# EAGLE schematic ER-524D_CoilDriver24 (EAGLE 7.4.0)
DOC_NUM: DR20000193; DOC_TITLE: Coil Driver 50ch; REV: 00
Assembly variants: 11Hz 1Vo-p, 80Hz 1Vo-p, ER-524D

## Sheet 1 of 4
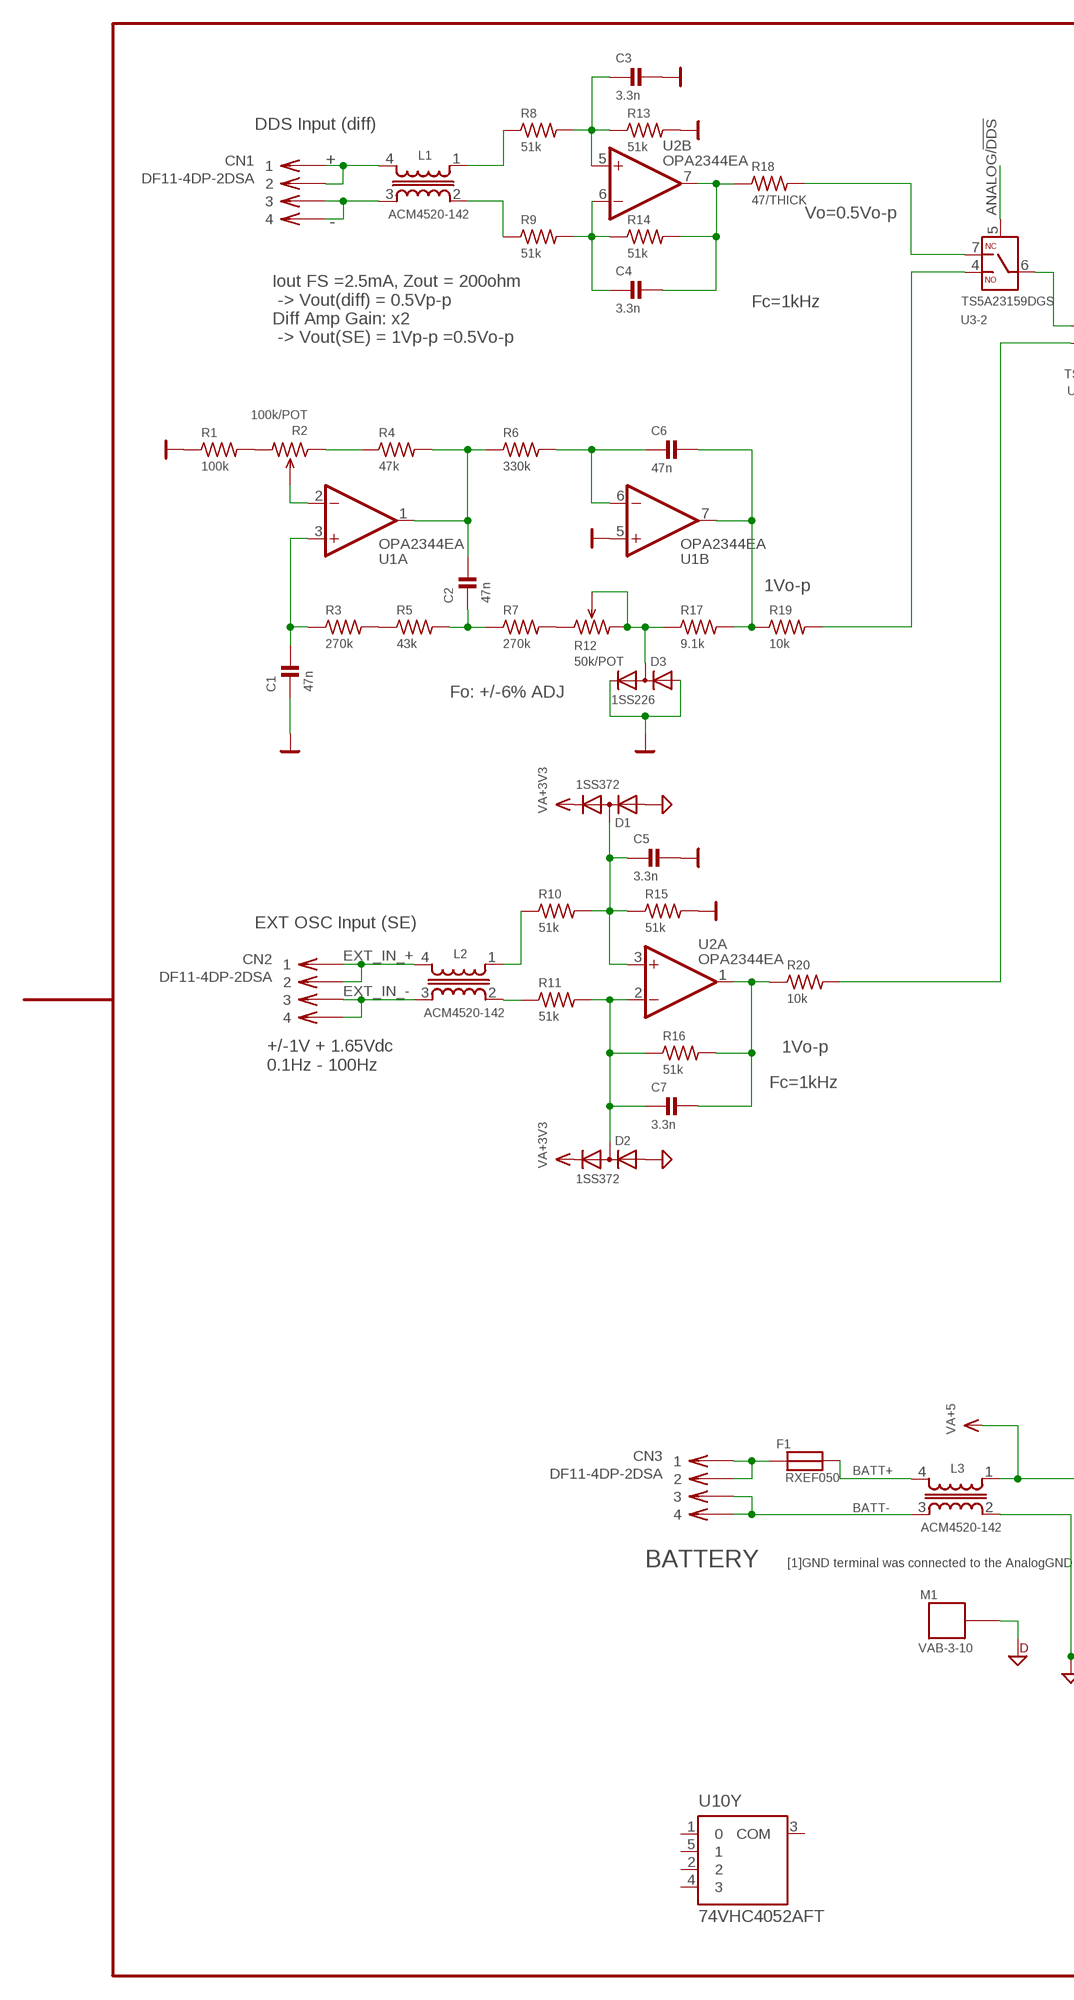
[diagram p0: schematic, sheet 1, part 1 of 2]
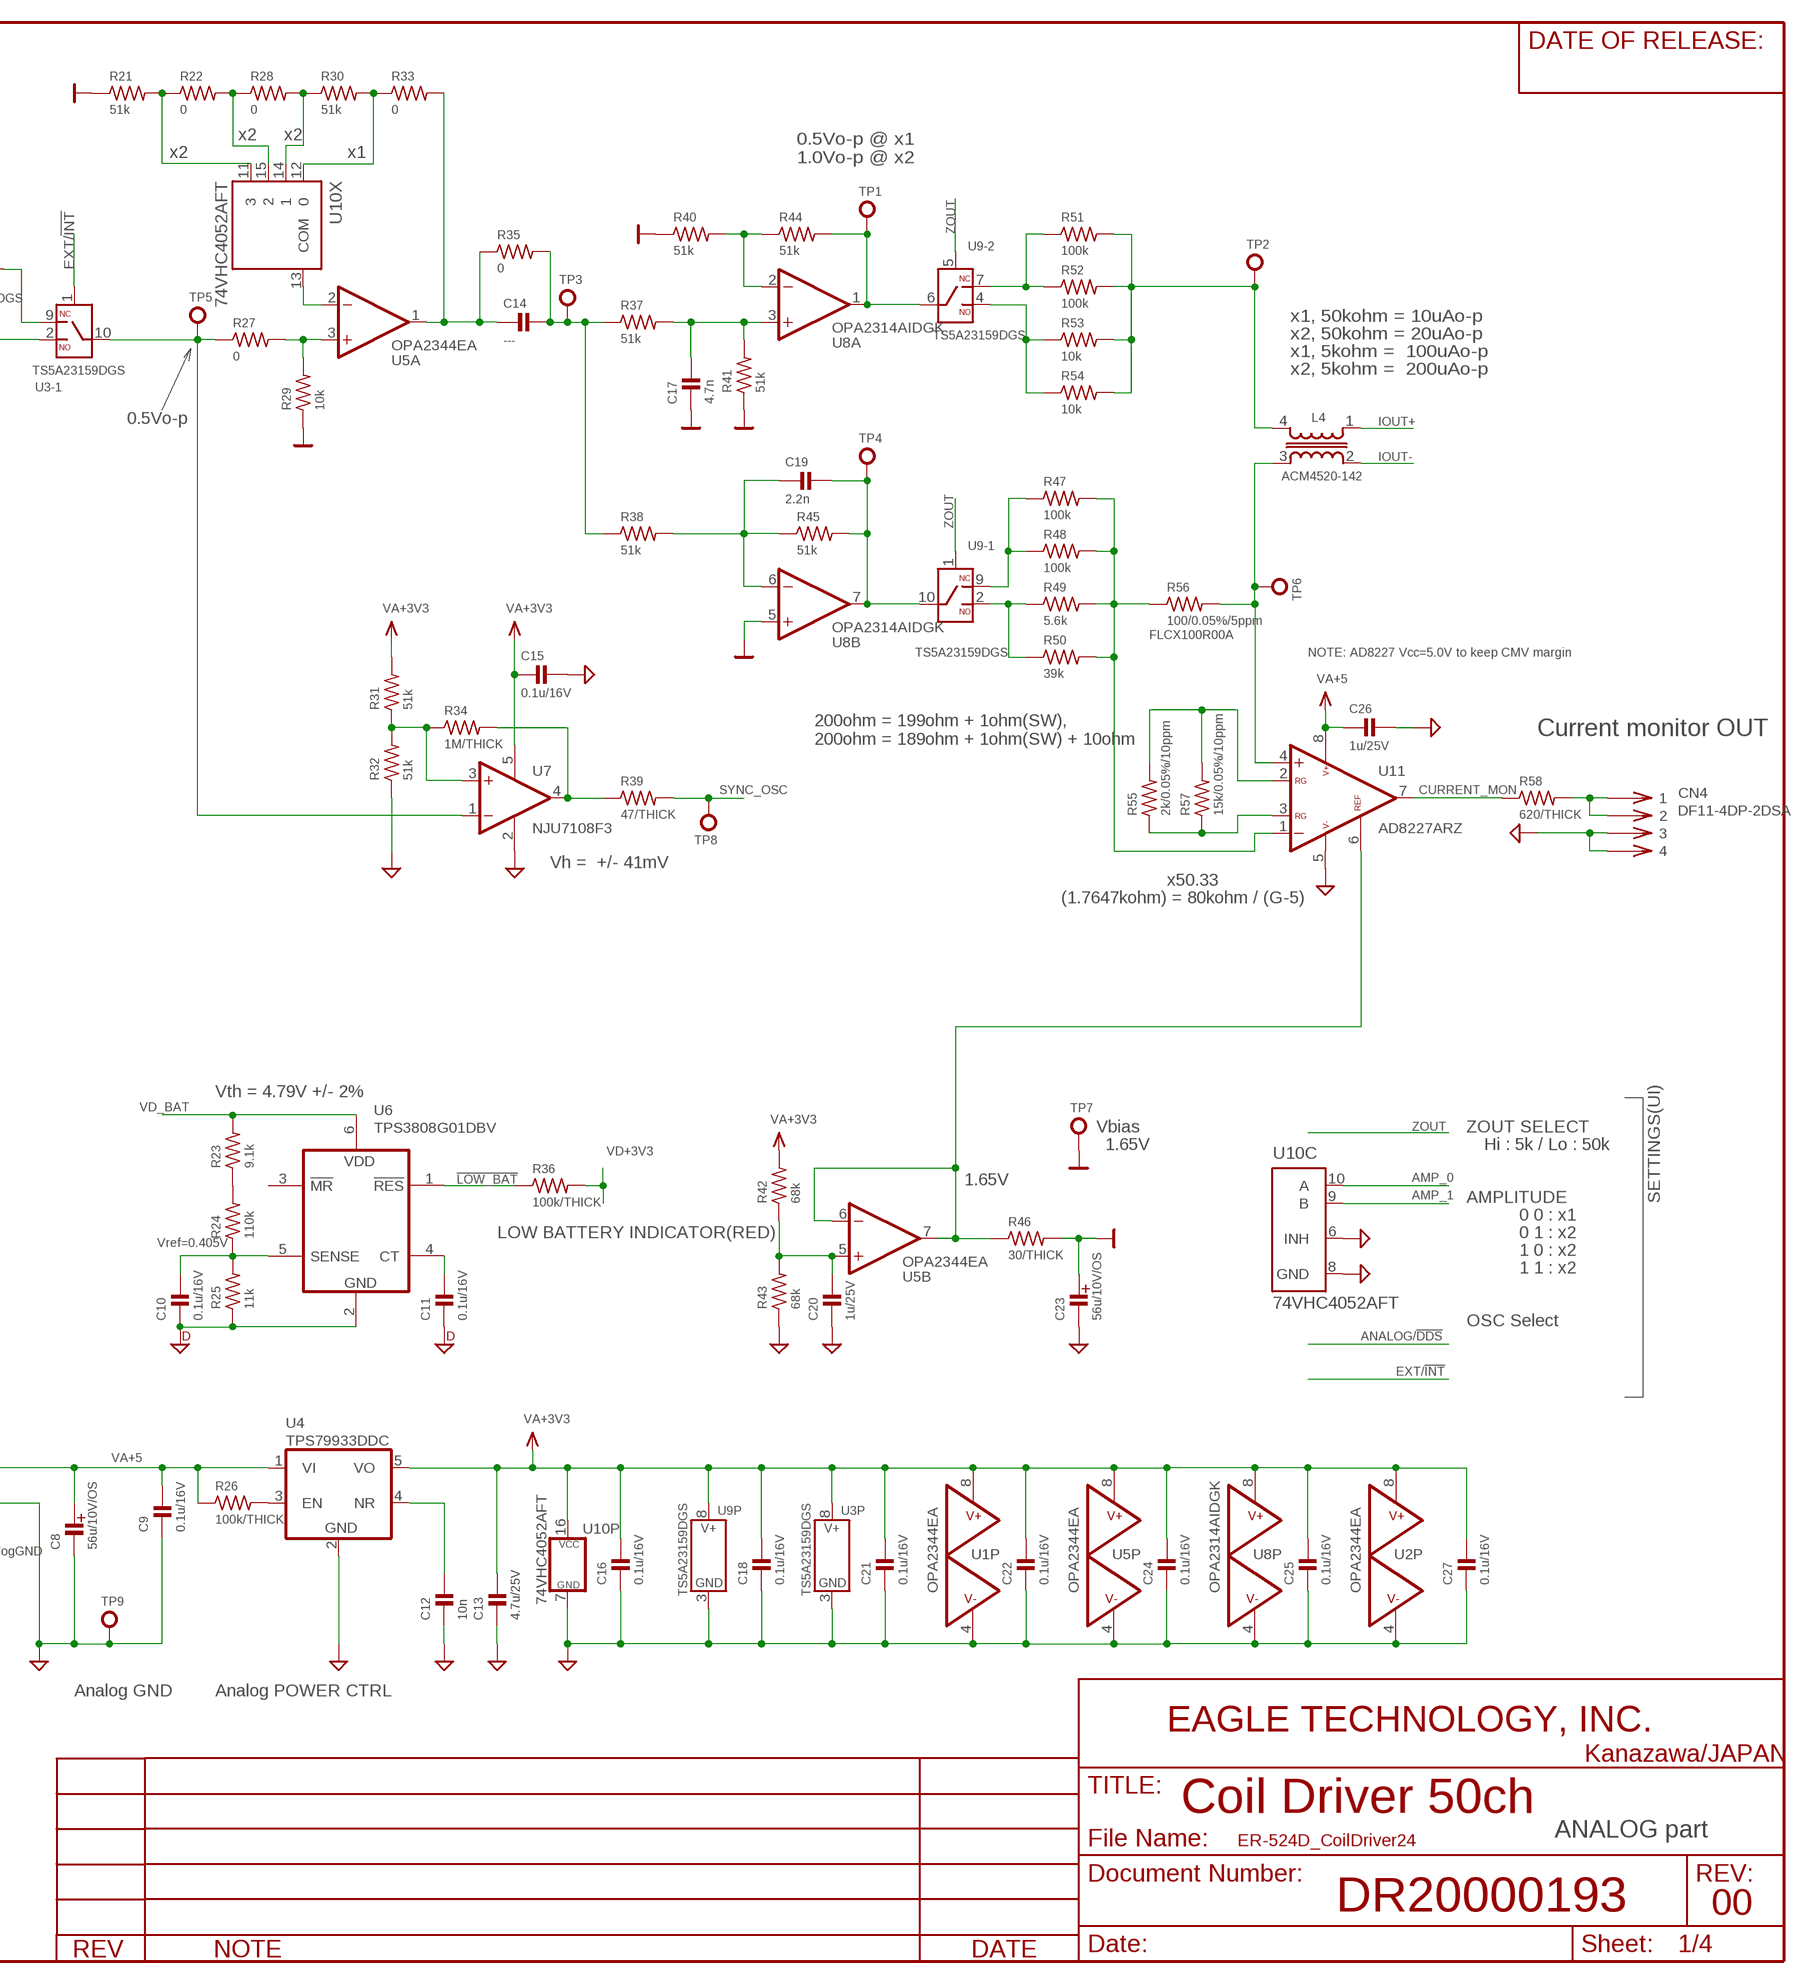
[diagram p1: schematic, sheet 1, part 2 of 2]

### Parts
C1  47n  CSMD3.2X1.6MM  [CM3216]  (not fitted in variant 80Hz 1Vo-p)  (not fitted in variant ER-524D)
C2  47n  CSMD3.2X1.6MM  [CM3216]  (not fitted in variant 80Hz 1Vo-p)  (not fitted in variant ER-524D)
C3  3.3n  CSMD2.0X1.2MM  [CM2012]
C4  3.3n  CSMD2.0X1.2MM  [CM2012]
C5  3.3n  CSMD2.0X1.2MM  [CM2012]
C6  47n  CSMD3.2X1.6MM  [CM3216]  (not fitted in variant 80Hz 1Vo-p)  (not fitted in variant ER-524D)
C7  3.3n  CSMD2.0X1.2MM  [CM2012]
C8  56u/10V/OS  C_POL6.3-2.5MM  [PHI_6.3]
C9  0.1u/16V  CSMD1.0X0.5MM  [CM1005]
C10  0.1u/16V  CSMD1.0X0.5MM  [CM1005]
C11  0.1u/16V  CSMD1.0X0.5MM  [CM1005]
C12  10n  CSMD2.0X1.2MM  [CM2012]
C13  4.7u/25V  CSMD2.0X1.2MM  [CM2012]
C14  ---  CSMD3.2X1.6MM  [CM3216]
C15  0.1u/16V  CSMD1.0X0.5MM  [CM1005]
C16  0.1u/16V  CSMD1.0X0.5MM  [CM1005]
C17  4.7n  CSMD2.0X1.2MM  [CM2012]
C18  0.1u/16V  CSMD1.0X0.5MM  [CM1005]
C19  2.2n  CSMD2.0X1.2MM  [CM2012]
C20  1u/25V  CSMD1.6X0.8MM  [CM1608]
C21  0.1u/16V  CSMD1.0X0.5MM  [CM1005]
C22  0.1u/16V  CSMD1.0X0.5MM  [CM1005]  (not fitted in variant ER-524D)
C23  56u/10V/OS  C_POL6.3-2.5MM  [PHI_6.3]
C24  0.1u/16V  CSMD1.0X0.5MM  [CM1005]
C25  0.1u/16V  CSMD1.0X0.5MM  [CM1005]
C26  1u/25V  CSMD1.6X0.8MM  [CM1608]
C27  0.1u/16V  CSMD1.0X0.5MM  [CM1005]
CN1  DF11-4DP-2DSA  [DF11-4DP-2DSA]
CN2  DF11-4DP-2DSA  [DF11-4DP-2DSA]
CN3  DF11-4DP-2DSA  [DF11-4DP-2DSA]
CN4  DF11-4DP-2DSA  [DF11-4DP-2DSA]
D1  1SS372  [SC70-3-R]
D2  1SS372  [SC70-3-R]
D3  1SS226  [SOT23]  (not fitted in variant 80Hz 1Vo-p)  (not fitted in variant ER-524D)
F1  RXEF050  [8X3/5.08]
L1  ACM4520-142  [ACM4520]
L2  ACM4520-142  [ACM4520]
L3  ACM4520-142  [ACM4520]
L4  ACM4520-142  [ACM4520]
M1  VAB-3-10  [VAB_3_10_CONTACT]
R1  100k  RSMD1.6X0.8MM  [RM1608]  (not fitted in variant 80Hz 1Vo-p)  (not fitted in variant ER-524D)
R2  100k/POT  R_POT  [CT-6]  (not fitted in variant 80Hz 1Vo-p)  (not fitted in variant ER-524D)
R3  270k  RSMD1.6X0.8MM  [RM1608]  (not fitted in variant 80Hz 1Vo-p)  (not fitted in variant ER-524D)
R4  47k  RSMD1.6X0.8MM  [RM1608]  (not fitted in variant 80Hz 1Vo-p)  (not fitted in variant ER-524D)
R5  43k  RSMD1.6X0.8MM  [RM1608]  (not fitted in variant 80Hz 1Vo-p)  (not fitted in variant ER-524D)
R6  330k  RSMD1.6X0.8MM  [RM1608]  (not fitted in variant 80Hz 1Vo-p)  (not fitted in variant ER-524D)
R7  270k  RSMD1.6X0.8MM  [RM1608]  (not fitted in variant 80Hz 1Vo-p)  (not fitted in variant ER-524D)
R8  51k  RSMD1.6X0.8MM  [RM1608]
R9  51k  RSMD1.6X0.8MM  [RM1608]
R10  51k  RSMD1.6X0.8MM  [RM1608]
R11  51k  RSMD1.6X0.8MM  [RM1608]
R12  50k/POT  R_POT  [CT-6]  (not fitted in variant 80Hz 1Vo-p)  (not fitted in variant ER-524D)
R13  51k  RSMD1.6X0.8MM  [RM1608]
R14  51k  RSMD1.6X0.8MM  [RM1608]
R15  51k  RSMD1.6X0.8MM  [RM1608]
R16  51k  RSMD1.6X0.8MM  [RM1608]
R17  9.1k  RSMD1.6X0.8MM  [RM1608]  (not fitted in variant 80Hz 1Vo-p)  (not fitted in variant ER-524D)
R18  47/THICK  RSMD1.6X0.8MM  [RM1608]
R19  10k  RSMD1.6X0.8MM  [RM1608]  (not fitted in variant 80Hz 1Vo-p)  (not fitted in variant ER-524D)
R20  10k  RSMD1.6X0.8MM  [RM1608]
R21  51k  RSMD1.6X0.8MM  [RM1608]
R22  0  RSMD1.6X0.8MM  [RM1608]
R23  9.1k  RSMD1.6X0.8MM  [RM1608]
R24  110k  RSMD1.6X0.8MM  [RM1608]
R25  11k  RSMD1.6X0.8MM  [RM1608]
R26  100k/THICK  RSMD1.6X0.8MM  [RM1608]
R27  0  RSMD1.6X0.8MM  [RM1608]
R28  0  RSMD1.6X0.8MM  [RM1608]
R29  10k  RSMD1.6X0.8MM  [RM1608]
R30  51k  RSMD1.6X0.8MM  [RM1608]
R31  51k  RSMD1.6X0.8MM  [RM1608]
R32  51k  RSMD1.6X0.8MM  [RM1608]
R33  0  RSMD1.6X0.8MM  [RM1608]
R34  1M/THICK  RSMD1.6X0.8MM  [RM1608]
R35  0  RSMD1.6X0.8MM  [RM1608]
R36  100k/THICK  RSMD1.6X0.8MM  [RM1608]
R37  51k  RSMD1.6X0.8MM  [RM1608]
R38  51k  RSMD1.6X0.8MM  [RM1608]
R39  47/THICK  RSMD1.6X0.8MM  [RM1608]
R40  51k  RSMD1.6X0.8MM  [RM1608]
R41  51k  RSMD1.6X0.8MM  [RM1608]
R42  68k  RSMD1.6X0.8MM  [RM1608]
R43  68k  RSMD1.6X0.8MM  [RM1608]
R44  51k  RSMD1.6X0.8MM  [RM1608]
R45  51k  RSMD1.6X0.8MM  [RM1608]
R46  30/THICK  RSMD1.6X0.8MM  [RM1608]
R47  100k  RSMD1.6X0.8MM  [RM1608]
R48  100k  RSMD1.6X0.8MM  [RM1608]
R49  5.6k  RSMD1.6X0.8MM  [RM1608]
R50  39k  RSMD1.6X0.8MM  [RM1608]
R51  100k  RSMD1.6X0.8MM  [RM1608]
R52  100k  RSMD1.6X0.8MM  [RM1608]
R53  10k  RSMD1.6X0.8MM  [RM1608]
R54  10k  RSMD1.6X0.8MM  [RM1608]
R55  2k/0.05%/10ppm  RSMD1.6X0.8MM  [RM1608]
R56  100/0.05%/5ppm  R0204/5  [0204/5]
R57  15k/0.05%/10ppm  RSMD1.6X0.8MM  [RM1608]
R58  620/THICK  RSMD1.6X0.8MM  [RM1608]
TP1  TP-LC3G  [TP_TH_0R9MM]
TP2  TP-LC3G  [TP_TH_0R9MM]
TP3  TP-LC3G  [TP_TH_0R9MM]
TP4  TP-LC3G  [TP_TH_0R9MM]
TP5  TP-LC3G  [TP_TH_0R9MM]
TP6  TP-LC3G  [TP_TH_0R9MM]
TP7  TP-LC3G  [TP_TH_0R9MM]
TP8  TP-LC3G  [TP_TH_0R9MM]
TP9  TP-LC3G  [TP_TH_0R9MM]
U1  OPA2344EA  [MSO8_AEL]  (not fitted in variant 80Hz 1Vo-p)  (not fitted in variant ER-524D)
U2  OPA2344EA  [MSO8_AEL]
U3  TS5A23159DGS  [MSOP10]
U4  TPS79933DDC  [SOT-23-5]
U5  OPA2344EA  [MSO8_AEL]
U6  TPS3808G01DBV  [SOT-23]
U7  NJU7108F3  [SC88A]
U8  OPA2314AIDGK  OPA2344EA  [MSO8_AEL]
U9  TS5A23159DGS  [MSOP10]
U10  74VHC4052AFT  [TSSOP16-P-044-065A]
U11  AD8227ARZ  [SO8_AEL]

### Nets
0V: C1.2 C3.1 C5.1 C17.2 C23.POS D3.1(A) D3.2(C) R1.1 R13.2 R15.2 R21.1 R29.1 R40.1 R41.1 R46.2 TP7.1(MP) U1.5(B:+IN) U8.5(B:+IN)
80_POWER: R26.2 U4.3(EN)
!LOW_BAT: R36.1 U6.1(!RESET) ; also sheet 4
AGND: C8.NEG C9.2 C12.2 C13.2 C15.1 C16.2 C18.2 C20.2 C21.2 C22.2 C23.NEG C24.2 C25.2 C26.1 C27.2 CN4.3 CN4.4 D1.1(A) D2.1(A) L3.2 R32.1 R43.1 TP9.1(MP) U1.4(P:V-) U2.4(P:V-) U3.3(P:V-) U4.2(GND) U5.4(P:V-) U7.2(V-) U8.4(P:V-) U9.3(P:V-) U10.6(C:INH) U10.7(P:GND) U10.8(C:GND) U11.5(V-) ; also sheet 2,3
AMP_0: U10.10(C:A) ; also sheet 4
AMP_1: U10.9(C:B) ; also sheet 4
ANALOG/!DDS!: U3.5(-2:IN) ; also sheet 4
BATT+: F1.2 L3.4 ; also sheet 4
BATT-: CN3.3 CN3.4 L3.3 ; also sheet 4
CURRENT_MON: R58.1 U11.7(OUT)
DGND: C10.2 C11.2 M1.CASE1 R25.1 U6.2(GND) ; also sheet 3,4
EXT/!INT!: U3.1(-1:IN) ; also sheet 4
EXT_IN_+: CN2.1 CN2.2 L2.4
EXT_IN_-: CN2.3 CN2.4 L2.3
IOUT+: L4.1 ; also sheet 2
IOUT-: L4.2 ; also sheet 2
N$4: L2.1 R10.1
N$9: U3.6(-2:COM) U3.9(-1:NC)
N$11: R7.2 R12.1
N$12: C3.2 R8.2 R13.1 U2.5(B:+IN)
N$13: R1.2 R2.3
N$14: C7.2 D2.3(AC) R11.2 R16.1 U2.2(A:-IN)
N$16: C6.1 R17.2 R19.1 U1.7(B:OUT)
N$18: L4.4 R51.2 R52.2 R53.2 R54.2 TP2.1(MP)
N$19: R21.2 R22.1 U10.11
N$20: C7.1 R16.2 R20.1 U2.1(A:OUT)
N$21: R22.2 R28.1 U10.15
N$22: R28.2 R30.1 U10.14
N$23: C5.2 D1.3(AC) R10.2 R15.1 U2.3(A:+IN)
N$24: L1.2 R9.1
N$25: R30.2 R33.1 U10.12
N$26: C20.1 R42.1 R43.2 U5.5(B:+IN)
N$27: C19.2 R38.2 R45.1 U8.6(B:-IN)
N$28: U5.2(A:-IN) U10.13(X:COM)
N$29: C14.2 R33.2 R35.1 U5.1(A:OUT)
N$30: R27.2 R29.2 U5.3(A:+IN)
N$31: C19.1 R45.2 TP4.1(MP) U8.7(B:OUT) U9.10(-1:COM)
N$32: R44.2 TP1.1(MP) U8.1(A:OUT) U9.6(-2:COM)
N$33: R40.2 R44.1 U8.2(A:-IN)
N$34: C17.1 R37.2 R41.2 U8.3(A:+IN)
N$35: R49.1 R50.1 U9.2(-1:NO)
N$36: R47.1 R48.1 U9.9(-1:NC)
N$37: R47.2 R48.2 R49.2 R50.2 R56.1 U11.1(-IN)
N$38: R51.1 R52.1 U9.7(-2:NC)
N$39: R53.1 R54.1 U9.4(-2:NO)
N$40: C4.1 R14.2 R18.1 U2.7(B:OUT)
N$41: R2.1 R4.1
N$42: C2.1 R4.2 R6.1 U1.1(A:OUT)
N$43: C6.2 R6.2 U1.6(B:-IN)
N$45: R2.2 U1.2(A:-IN)
N$46: C1.1 R3.1 U1.3(A:+IN)
N$47: R3.2 R5.1
N$48: C2.2 R5.2 R7.1
N$49: D3.3(AC) R12.2 R12.3 R17.1
N$51: C14.1 R35.2 R37.1 R38.1 TP3.1(MP)
N$52: L4.3 R56.2 TP6.1(MP) U11.4(+IN)
N$53: C4.2 R9.2 R14.1 U2.6(B:-IN)
N$54: CN1.3 CN1.4 L1.3
N$55: CN1.1 CN1.2 L1.4
N$57: R31.1 R32.2 R34.1 U7.3(+IN)
N$58: R34.2 R39.1 U7.4(OUT)
N$59: CN3.1 CN3.2 F1.1
N$60: C11.1 U6.4(CT)
N$61: L1.1 R8.1
N$62: C10.1 R24.1 R25.2 U6.5(SENSE)
N$63: CN4.1 CN4.2 R58.2
N$64: C12.1 U4.4(NR)
N$65: L2.2 R11.1
N$66: R20.2 U3.2(-1:NO)
N$68: R18.2 U3.7(-2:NC)
N$69: R27.1 TP5.1(MP) U3.10(-1:COM) U7.1(-IN)
N$73: R19.2 U3.4(-2:NO)
N$76: R23.1 R24.2
N$84: R55.1 R57.1 U11.3(RG2)
N$85: R55.2 R57.2 U11.2(RG1)
N$92: R46.1 U5.6(B:-IN) U5.7(B:OUT) U11.6(REF)
SYNC_OSC: R39.2 TP8.1(MP) ; also sheet 4
VA+3V3: C13.1 C15.2 C16.1 C18.1 C21.1 C22.1 C24.1 C25.1 C27.1 D1.2(C) D2.2(C) R31.2 R42.2 U1.8(P:V+) U2.8(P:V+) U3.8(P:V+) U4.5(VO) U5.8(P:V+) U7.5(V+) U8.8(P:V+) U9.8(P:V+) U10.16(P:VCC) ; also sheet 2
VA+5: C8.POS C9.1 C26.2 L3.1 R26.1 U4.1(VI) U11.8(V+)
VD+3V3: R36.2 ; also sheet 4
VD_BAT: R23.2 U6.6(VDD) ; also sheet 4
ZOUT: U9.1(-1:IN) U9.5(-2:IN) ; also sheet 4
Unconnected: U6.3(!MR) U10.1 U10.2 U10.3(Y:COM) U10.4 U10.5

### Notes on the sheet
- DDS Input (diff)
- x2 | x2
- x2 | x1
- +
- 0.5Vo-p @ x1
  1.0Vo-p @ x2
- Vo=0.5Vo-p
- -
- Fc=1kHz
- x1, 50kohm = 10uAo-p
- Iout FS =2.5mA, Zout = 200ohm
   -> Vout(diff) = 0.5Vp-p
  Diff Amp Gain: x2
   -> Vout(SE) = 1Vp-p =0.5Vo-p
- x2, 50kohm = 20uAo-p
- x1, 5kohm =  100uAo-p
- x2, 5kohm =  200uAo-p
- 0.5Vo-p
- 1Vo-p
- FLCX100R00A
- NOTE: AD8227 Vcc=5.0V to keep CMV margin
- Fo: +/-6% ADJ
- 200ohm = 199ohm + 1ohm(SW),
  200ohm = 189ohm + 1ohm(SW) + 10ohm
- Current monitor OUT
- Vh =  +/- 41mV
- x50.33
- (1.7647kohm) = 80kohm / (G-5)
- EXT OSC Input (SE)
- 1Vo-p
- +/-1V + 1.65Vdc
  0.1Hz - 100Hz
- Fc=1kHz
- Vth = 4.79V +/- 2%
- Vbias | ZOUT SELECT
- 1.65V | Hi : 5k / Lo : 50k
- 1.65V
- AMPLITUDE | SETTINGS(UI)
- 0 0 : x1
- LOW BATTERY INDICATOR(RED) | 0 1 : x2
- Vref=0.405V
- 1 0 : x2
- 1 1 : x2
- OSC Select
- BATTERY | [1]GND terminal was connected to the AnalogGND
- Analog GND | Analog POWER CTRL
- ANALOG part

## Sheet 2 of 4
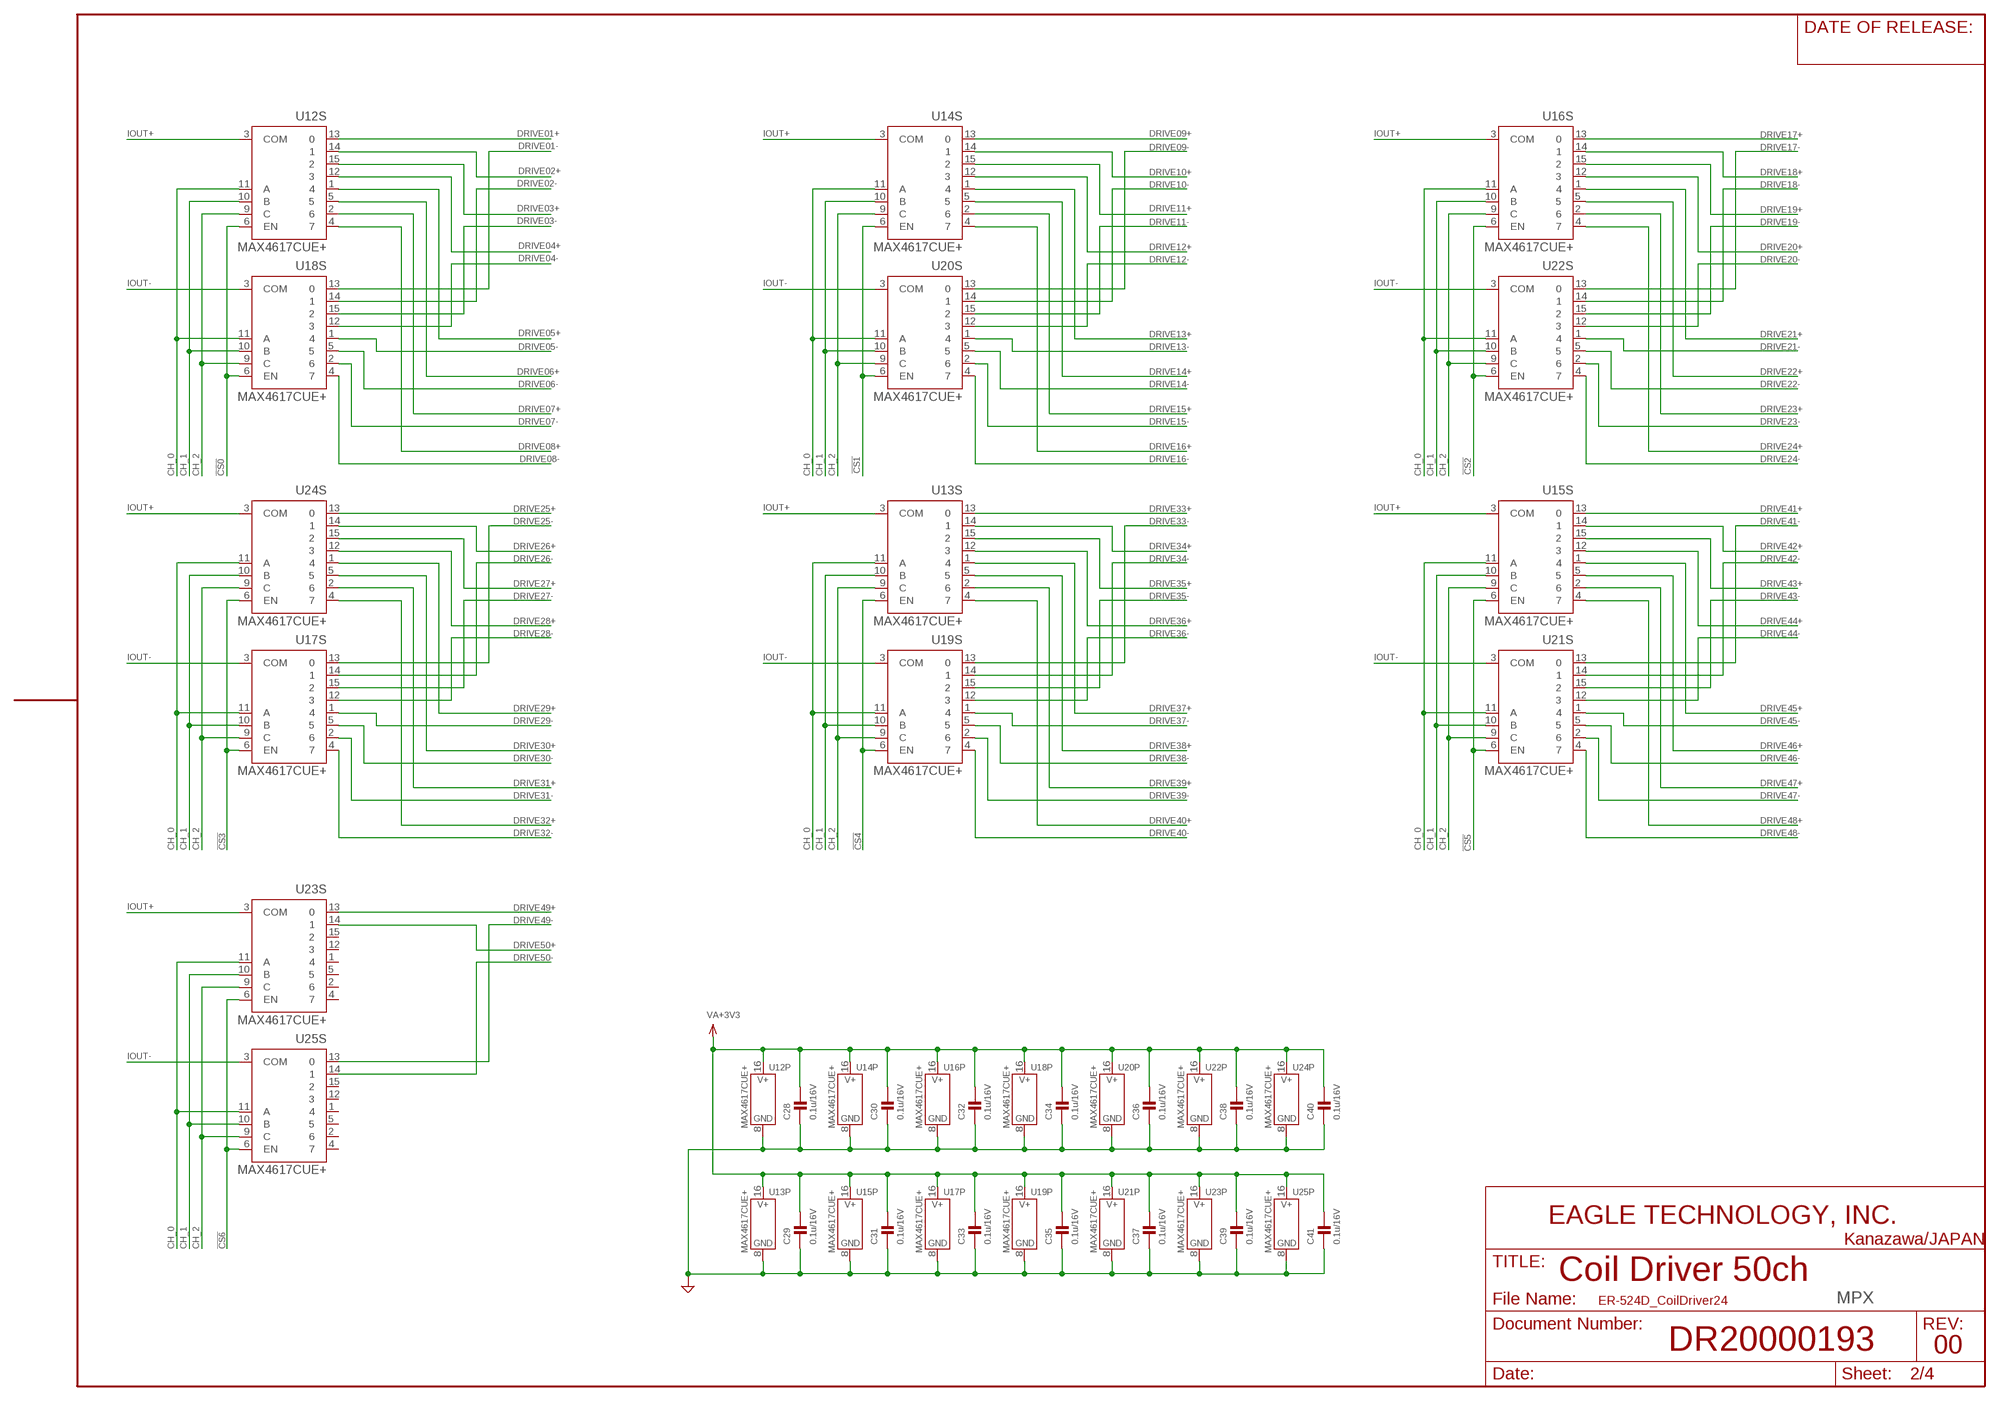
[diagram p2: schematic, sheet 2]

### Parts
C28  0.1u/16V  CSMD1.0X0.5MM  [CM1005]
C29  0.1u/16V  CSMD1.0X0.5MM  [CM1005]  (not fitted in variant 80Hz 1Vo-p)  (not fitted in variant ER-524D)
C30  0.1u/16V  CSMD1.0X0.5MM  [CM1005]
C31  0.1u/16V  CSMD1.0X0.5MM  [CM1005]  (not fitted in variant 80Hz 1Vo-p)  (not fitted in variant ER-524D)
C32  0.1u/16V  CSMD1.0X0.5MM  [CM1005]
C33  0.1u/16V  CSMD1.0X0.5MM  [CM1005]  (not fitted in variant 80Hz 1Vo-p)  (not fitted in variant ER-524D)
C34  0.1u/16V  CSMD1.0X0.5MM  [CM1005]
C35  0.1u/16V  CSMD1.0X0.5MM  [CM1005]  (not fitted in variant 80Hz 1Vo-p)  (not fitted in variant ER-524D)
C36  0.1u/16V  CSMD1.0X0.5MM  [CM1005]
C37  0.1u/16V  CSMD1.0X0.5MM  [CM1005]  (not fitted in variant 80Hz 1Vo-p)  (not fitted in variant ER-524D)
C38  0.1u/16V  CSMD1.0X0.5MM  [CM1005]
C39  0.1u/16V  CSMD1.0X0.5MM  [CM1005]
C40  0.1u/16V  CSMD1.0X0.5MM  [CM1005]  (not fitted in variant 80Hz 1Vo-p)  (not fitted in variant ER-524D)
C41  0.1u/16V  CSMD1.0X0.5MM  [CM1005]
U12  MAX4617CUE+  [TSSOP16_AEL]
U13  MAX4617CUE+  [TSSOP16_AEL]  (not fitted in variant 80Hz 1Vo-p)  (not fitted in variant ER-524D)
U14  MAX4617CUE+  [TSSOP16_AEL]
U15  MAX4617CUE+  [TSSOP16_AEL]  (not fitted in variant 80Hz 1Vo-p)  (not fitted in variant ER-524D)
U16  MAX4617CUE+  [TSSOP16_AEL]
U17  MAX4617CUE+  [TSSOP16_AEL]  (not fitted in variant 80Hz 1Vo-p)  (not fitted in variant ER-524D)
U18  MAX4617CUE+  [TSSOP16_AEL]
U19  MAX4617CUE+  [TSSOP16_AEL]  (not fitted in variant 80Hz 1Vo-p)  (not fitted in variant ER-524D)
U20  MAX4617CUE+  [TSSOP16_AEL]
U21  MAX4617CUE+  [TSSOP16_AEL]  (not fitted in variant 80Hz 1Vo-p)  (not fitted in variant ER-524D)
U22  MAX4617CUE+  [TSSOP16_AEL]
U23  MAX4617CUE+  [TSSOP16_AEL]
U24  MAX4617CUE+  [TSSOP16_AEL]  (not fitted in variant 80Hz 1Vo-p)  (not fitted in variant ER-524D)
U25  MAX4617CUE+  [TSSOP16_AEL]

### Nets
!CS0: U12.6(S:EN) U18.6(S:EN) ; also sheet 4
!CS1: U14.6(S:EN) U20.6(S:EN) ; also sheet 4
!CS2: U16.6(S:EN) U22.6(S:EN) ; also sheet 4
!CS3: U17.6(S:EN) U24.6(S:EN) ; also sheet 4
!CS4: U13.6(S:EN) U19.6(S:EN) ; also sheet 4
!CS5: U15.6(S:EN) U21.6(S:EN) ; also sheet 4
!CS6: U23.6(S:EN) U25.6(S:EN) ; also sheet 4
AGND: C28.2 C29.2 C30.2 C31.2 C32.2 C33.2 C34.2 C35.2 C36.2 C37.2 C38.2 C39.2 C40.2 C41.2 U12.8(P:V-) U13.8(P:V-) U14.8(P:V-) U15.8(P:V-) U16.8(P:V-) U17.8(P:V-) U18.8(P:V-) U19.8(P:V-) U20.8(P:V-) U21.8(P:V-) U22.8(P:V-) U23.8(P:V-) U24.8(P:V-) U25.8(P:V-) ; also sheet 1,3
CH_0: U12.11(S:A) U13.11(S:A) U14.11(S:A) U15.11(S:A) U16.11(S:A) U17.11(S:A) U18.11(S:A) U19.11(S:A) U20.11(S:A) U21.11(S:A) U22.11(S:A) U23.11(S:A) U24.11(S:A) U25.11(S:A) ; also sheet 4
CH_1: U12.10(S:B) U13.10(S:B) U14.10(S:B) U15.10(S:B) U16.10(S:B) U17.10(S:B) U18.10(S:B) U19.10(S:B) U20.10(S:B) U21.10(S:B) U22.10(S:B) U23.10(S:B) U24.10(S:B) U25.10(S:B) ; also sheet 4
CH_2: U12.9(S:C) U13.9(S:C) U14.9(S:C) U15.9(S:C) U16.9(S:C) U17.9(S:C) U18.9(S:C) U19.9(S:C) U20.9(S:C) U21.9(S:C) U22.9(S:C) U23.9(S:C) U24.9(S:C) U25.9(S:C) ; also sheet 4
DRIVE01+: U12.13 ; also sheet 3
DRIVE01-: U18.13 ; also sheet 3
DRIVE02+: U12.14 ; also sheet 3
DRIVE02-: U18.14 ; also sheet 3
DRIVE03+: U12.15 ; also sheet 3
DRIVE03-: U18.15 ; also sheet 3
DRIVE04+: U12.12 ; also sheet 3
DRIVE04-: U18.12 ; also sheet 3
DRIVE05+: U12.1 ; also sheet 3
DRIVE05-: U18.1 ; also sheet 3
DRIVE06+: U12.5 ; also sheet 3
DRIVE06-: U18.5 ; also sheet 3
DRIVE07+: U12.2 ; also sheet 3
DRIVE07-: U18.2 ; also sheet 3
DRIVE08+: U12.4 ; also sheet 3
DRIVE08-: U18.4 ; also sheet 3
DRIVE09+: U14.13 ; also sheet 3
DRIVE09-: U20.13 ; also sheet 3
DRIVE10+: U14.14 ; also sheet 3
DRIVE10-: U20.14 ; also sheet 3
DRIVE11+: U14.15 ; also sheet 3
DRIVE11-: U20.15 ; also sheet 3
DRIVE12+: U14.12 ; also sheet 3
DRIVE12-: U20.12 ; also sheet 3
DRIVE13+: U14.1 ; also sheet 3
DRIVE13-: U20.1 ; also sheet 3
DRIVE14+: U14.5 ; also sheet 3
DRIVE14-: U20.5 ; also sheet 3
DRIVE15+: U14.2 ; also sheet 3
DRIVE15-: U20.2 ; also sheet 3
DRIVE16+: U14.4 ; also sheet 3
DRIVE16-: U20.4 ; also sheet 3
DRIVE17+: U16.13 ; also sheet 3
DRIVE17-: U22.13 ; also sheet 3
DRIVE18+: U16.14 ; also sheet 3
DRIVE18-: U22.14 ; also sheet 3
DRIVE19+: U16.15 ; also sheet 3
DRIVE19-: U22.15 ; also sheet 3
DRIVE20+: U16.12 ; also sheet 3
DRIVE20-: U22.12 ; also sheet 3
DRIVE21+: U16.1 ; also sheet 3
DRIVE21-: U22.1 ; also sheet 3
DRIVE22+: U16.5 ; also sheet 3
DRIVE22-: U22.5 ; also sheet 3
DRIVE23+: U16.2 ; also sheet 3
DRIVE23-: U22.2 ; also sheet 3
DRIVE24+: U16.4 ; also sheet 3
DRIVE24-: U22.4 ; also sheet 3
DRIVE25+: U24.13 ; also sheet 3
DRIVE25-: U17.13 ; also sheet 3
DRIVE26+: U24.14 ; also sheet 3
DRIVE26-: U17.14 ; also sheet 3
DRIVE27+: U24.15 ; also sheet 3
DRIVE27-: U17.15 ; also sheet 3
DRIVE28+: U24.12 ; also sheet 3
DRIVE28-: U17.12 ; also sheet 3
DRIVE29+: U24.1 ; also sheet 3
DRIVE29-: U17.1 ; also sheet 3
DRIVE30+: U24.5 ; also sheet 3
DRIVE30-: U17.5 ; also sheet 3
DRIVE31+: U24.2 ; also sheet 3
DRIVE31-: U17.2 ; also sheet 3
DRIVE32+: U24.4 ; also sheet 3
DRIVE32-: U17.4 ; also sheet 3
DRIVE33+: U13.13 ; also sheet 3
DRIVE33-: U19.13 ; also sheet 3
DRIVE34+: U13.14 ; also sheet 3
DRIVE34-: U19.14 ; also sheet 3
DRIVE35+: U13.15 ; also sheet 3
DRIVE35-: U19.15 ; also sheet 3
DRIVE36+: U13.12 ; also sheet 3
DRIVE36-: U19.12 ; also sheet 3
DRIVE37+: U13.1 ; also sheet 3
DRIVE37-: U19.1 ; also sheet 3
DRIVE38+: U13.5 ; also sheet 3
DRIVE38-: U19.5 ; also sheet 3
DRIVE39+: U13.2 ; also sheet 3
DRIVE39-: U19.2 ; also sheet 3
DRIVE40+: U13.4 ; also sheet 3
DRIVE40-: U19.4 ; also sheet 3
DRIVE41+: U15.13 ; also sheet 3
DRIVE41-: U21.13 ; also sheet 3
DRIVE42+: U15.14 ; also sheet 3
DRIVE42-: U21.14 ; also sheet 3
DRIVE43+: U15.15 ; also sheet 3
DRIVE43-: U21.15 ; also sheet 3
DRIVE44+: U15.12 ; also sheet 3
DRIVE44-: U21.12 ; also sheet 3
DRIVE45+: U15.1 ; also sheet 3
DRIVE45-: U21.1 ; also sheet 3
DRIVE46+: U15.5 ; also sheet 3
DRIVE46-: U21.5 ; also sheet 3
DRIVE47+: U15.2 ; also sheet 3
DRIVE47-: U21.2 ; also sheet 3
DRIVE48+: U15.4 ; also sheet 3
DRIVE48-: U21.4 ; also sheet 3
DRIVE49+: U23.13 ; also sheet 3
DRIVE49-: U25.13 ; also sheet 3
DRIVE50+: U23.14 ; also sheet 3
DRIVE50-: U25.14 ; also sheet 3
IOUT+: U12.3(S:COM) U13.3(S:COM) U14.3(S:COM) U15.3(S:COM) U16.3(S:COM) U23.3(S:COM) U24.3(S:COM) ; also sheet 1
IOUT-: U17.3(S:COM) U18.3(S:COM) U19.3(S:COM) U20.3(S:COM) U21.3(S:COM) U22.3(S:COM) U25.3(S:COM) ; also sheet 1
VA+3V3: C28.1 C29.1 C30.1 C31.1 C32.1 C33.1 C34.1 C35.1 C36.1 C37.1 C38.1 C39.1 C40.1 C41.1 U12.16(P:V+) U13.16(P:V+) U14.16(P:V+) U15.16(P:V+) U16.16(P:V+) U17.16(P:V+) U18.16(P:V+) U19.16(P:V+) U20.16(P:V+) U21.16(P:V+) U22.16(P:V+) U23.16(P:V+) U24.16(P:V+) U25.16(P:V+) ; also sheet 1
Unconnected: U23.1 U23.2 U23.4 U23.5 U23.12 U23.15 U25.1 U25.2 U25.4 U25.5 U25.12 U25.15

### Notes on the sheet
- MPX

## Sheet 3 of 4
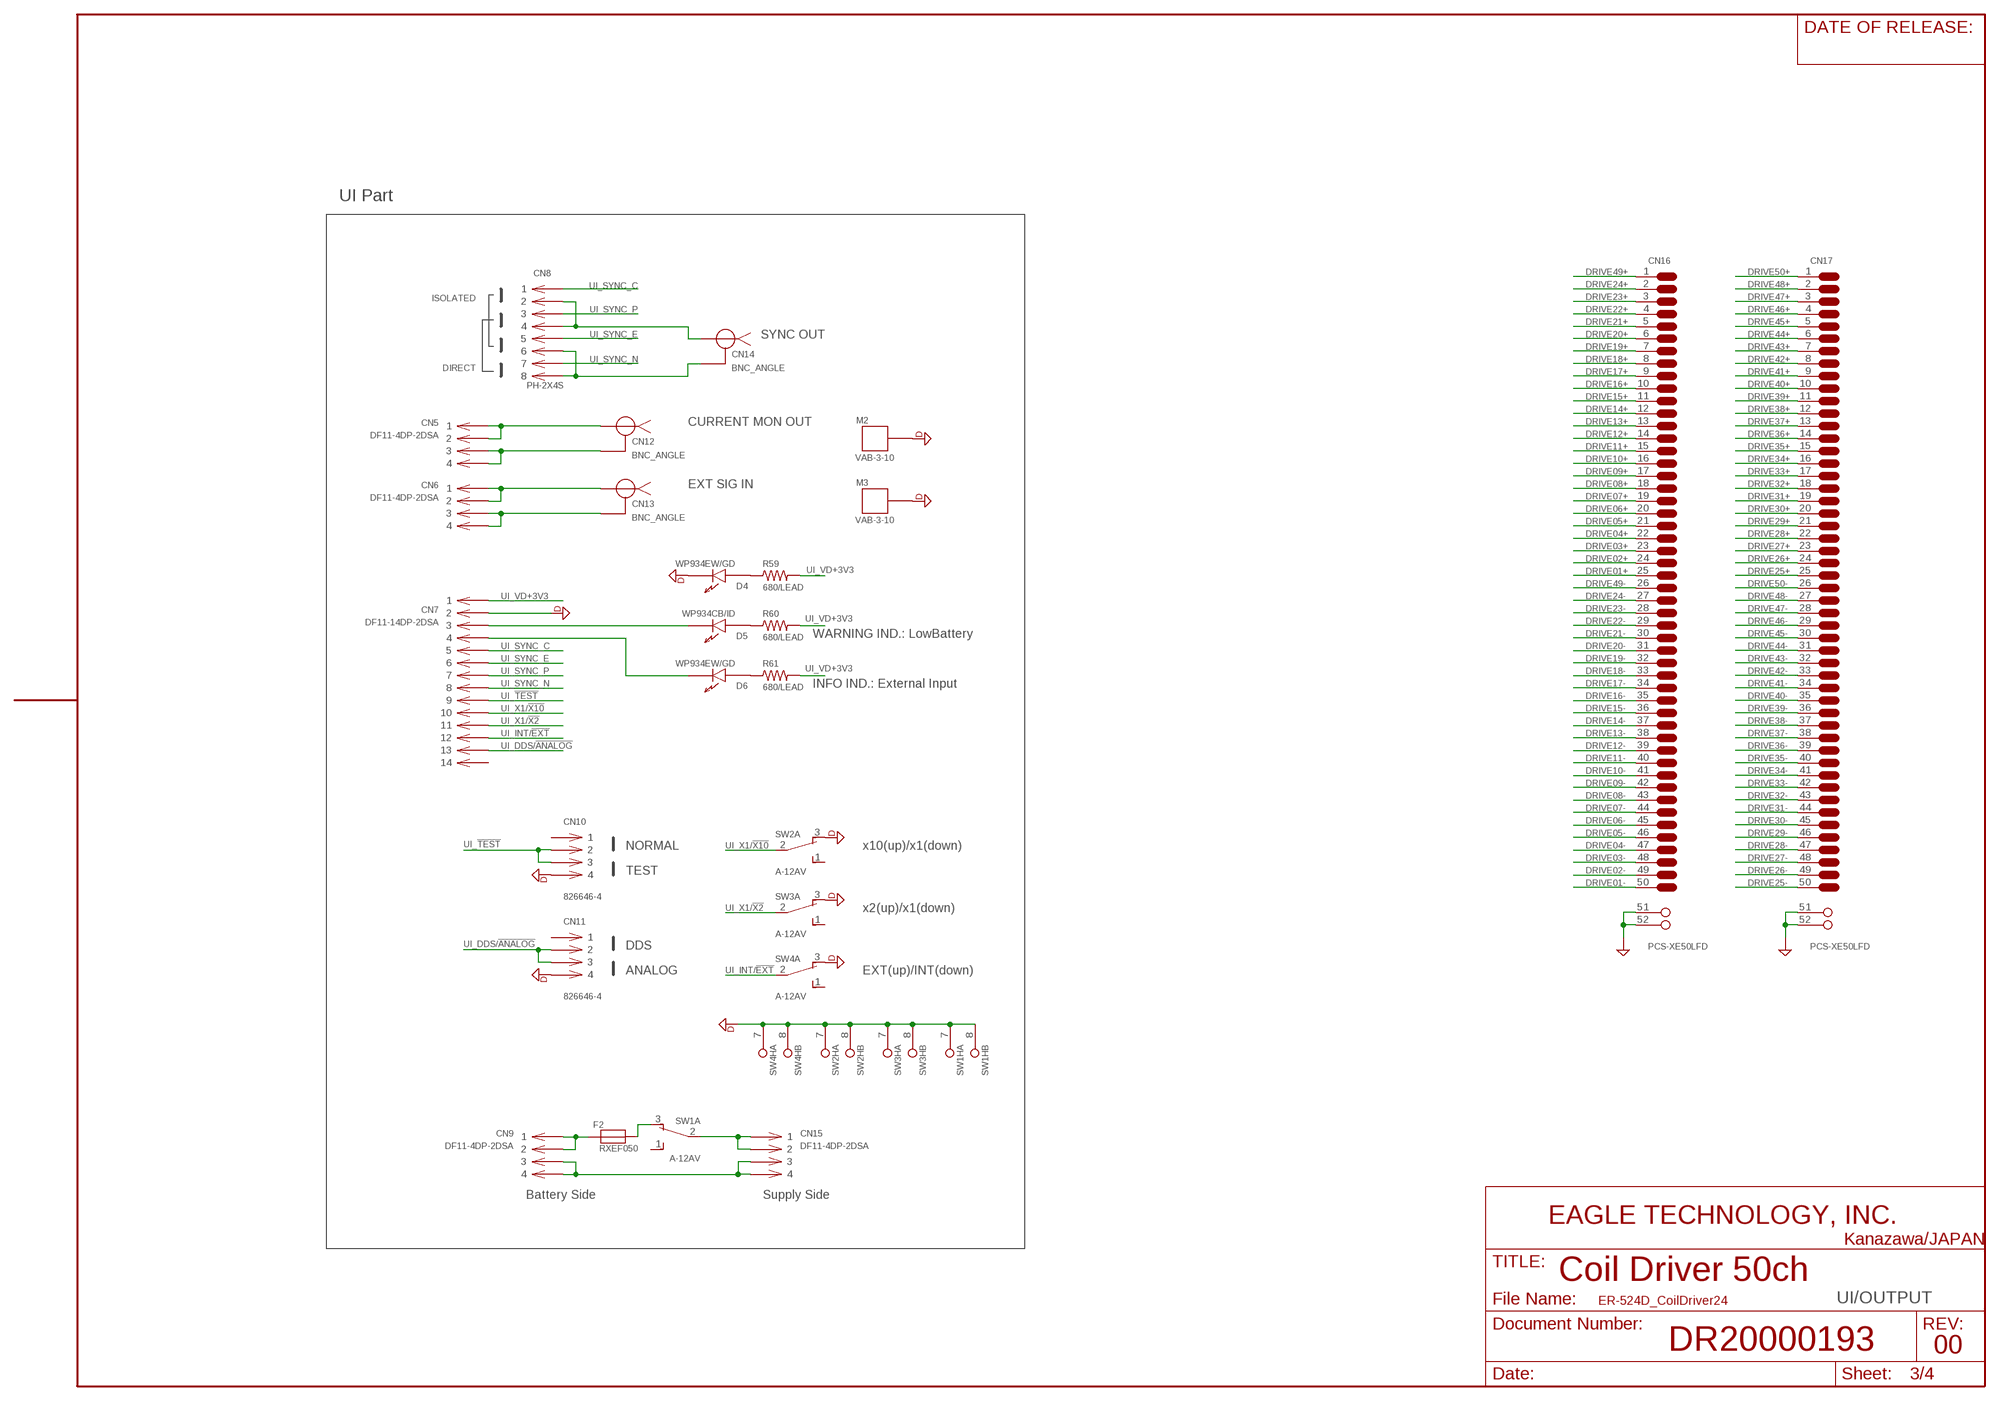
[diagram p3: schematic, sheet 3]

### Parts
CN5  DF11-4DP-2DSA  [DF11-4DP-2DSA]
CN6  DF11-4DP-2DSA  [DF11-4DP-2DSA]  (not fitted in variant ER-524D)
CN7  DF11-14DP-2DSA  [DF11-14DP-2DSA]
CN8  PH-2X4S  [PIN_HEADER_8PIN]
CN9  DF11-4DP-2DSA  [DF11-4DP-2DSA]
CN10  826646-4  PH-1X4  [PIN_HEADER_4PIN]
CN11  826646-4  PH-1X4  [PIN_HEADER_4PIN]  (not fitted in variant ER-524D)
CN12  BNC_ANGLE  [BNC_F_ANGLE]
CN13  BNC_ANGLE  [BNC_F_ANGLE]  (not fitted in variant ER-524D)
CN14  BNC_ANGLE  [BNC_F_ANGLE]
CN15  DF11-4DP-2DSA  [DF11-4DP-2DSA]
CN16  PCS-XE50LFD  [50LFD2]
CN17  PCS-XE50LFD  [50LFD2]  (not fitted in variant 80Hz 1Vo-p)  (not fitted in variant ER-524D)
D4  WP934EW/GD  L-93A8CB/1GD  [L-93A8CB]
D5  WP934CB/ID  L-93A8CB/1ID  [L-93A8CB]
D6  WP934EW/GD  L-93A8CB/1GD  [L-93A8CB]  (not fitted in variant ER-524D)
F2  RXEF050  [8X3/5.08]
M2  VAB-3-10  [VAB_3_10_CONTACT]
M3  VAB-3-10  [VAB_3_10_CONTACT]
R59  680/LEAD  R0207/2V  [0207/2V]
R60  680/LEAD  R0207/2V  [0207/2V]
R61  680/LEAD  R0207/2V  [0207/2V]  (not fitted in variant ER-524D)
SW1  A-12AV  [A-12*]
SW2  A-12AV  [A-12*]
SW3  A-12AV  [A-12*]
SW4  A-12AV  [A-12*]  (not fitted in variant ER-524D)

### Nets
AGND: CN16.51(G1) CN16.52(G2) CN17.51(G1) CN17.52(G2) ; also sheet 1,2
DGND: CN7.2 CN10.4 CN11.4 D4.C(K1) M2.CASE1 M3.CASE1 SW1.7(HA:BRACKET) SW1.8(HB:BRACKET) SW2.3(A:NC) SW2.7(HA:BRACKET) SW2.8(HB:BRACKET) SW3.3(A:NC) SW3.7(HA:BRACKET) SW3.8(HB:BRACKET) SW4.3(A:NC) SW4.7(HA:BRACKET) SW4.8(HB:BRACKET) ; also sheet 1,4
DRIVE01+: CN16.25 ; also sheet 2
DRIVE01-: CN16.50 ; also sheet 2
DRIVE02+: CN16.24 ; also sheet 2
DRIVE02-: CN16.49 ; also sheet 2
DRIVE03+: CN16.23 ; also sheet 2
DRIVE03-: CN16.48 ; also sheet 2
DRIVE04+: CN16.22 ; also sheet 2
DRIVE04-: CN16.47 ; also sheet 2
DRIVE05+: CN16.21 ; also sheet 2
DRIVE05-: CN16.46 ; also sheet 2
DRIVE06+: CN16.20 ; also sheet 2
DRIVE06-: CN16.45 ; also sheet 2
DRIVE07+: CN16.19 ; also sheet 2
DRIVE07-: CN16.44 ; also sheet 2
DRIVE08+: CN16.18 ; also sheet 2
DRIVE08-: CN16.43 ; also sheet 2
DRIVE09+: CN16.17 ; also sheet 2
DRIVE09-: CN16.42 ; also sheet 2
DRIVE10+: CN16.16 ; also sheet 2
DRIVE10-: CN16.41 ; also sheet 2
DRIVE11+: CN16.15 ; also sheet 2
DRIVE11-: CN16.40 ; also sheet 2
DRIVE12+: CN16.14 ; also sheet 2
DRIVE12-: CN16.39 ; also sheet 2
DRIVE13+: CN16.13 ; also sheet 2
DRIVE13-: CN16.38 ; also sheet 2
DRIVE14+: CN16.12 ; also sheet 2
DRIVE14-: CN16.37 ; also sheet 2
DRIVE15+: CN16.11 ; also sheet 2
DRIVE15-: CN16.36 ; also sheet 2
DRIVE16+: CN16.10 ; also sheet 2
DRIVE16-: CN16.35 ; also sheet 2
DRIVE17+: CN16.9 ; also sheet 2
DRIVE17-: CN16.34 ; also sheet 2
DRIVE18+: CN16.8 ; also sheet 2
DRIVE18-: CN16.33 ; also sheet 2
DRIVE19+: CN16.7 ; also sheet 2
DRIVE19-: CN16.32 ; also sheet 2
DRIVE20+: CN16.6 ; also sheet 2
DRIVE20-: CN16.31 ; also sheet 2
DRIVE21+: CN16.5 ; also sheet 2
DRIVE21-: CN16.30 ; also sheet 2
DRIVE22+: CN16.4 ; also sheet 2
DRIVE22-: CN16.29 ; also sheet 2
DRIVE23+: CN16.3 ; also sheet 2
DRIVE23-: CN16.28 ; also sheet 2
DRIVE24+: CN16.2 ; also sheet 2
DRIVE24-: CN16.27 ; also sheet 2
DRIVE25+: CN17.25 ; also sheet 2
DRIVE25-: CN17.50 ; also sheet 2
DRIVE26+: CN17.24 ; also sheet 2
DRIVE26-: CN17.49 ; also sheet 2
DRIVE27+: CN17.23 ; also sheet 2
DRIVE27-: CN17.48 ; also sheet 2
DRIVE28+: CN17.22 ; also sheet 2
DRIVE28-: CN17.47 ; also sheet 2
DRIVE29+: CN17.21 ; also sheet 2
DRIVE29-: CN17.46 ; also sheet 2
DRIVE30+: CN17.20 ; also sheet 2
DRIVE30-: CN17.45 ; also sheet 2
DRIVE31+: CN17.19 ; also sheet 2
DRIVE31-: CN17.44 ; also sheet 2
DRIVE32+: CN17.18 ; also sheet 2
DRIVE32-: CN17.43 ; also sheet 2
DRIVE33+: CN17.17 ; also sheet 2
DRIVE33-: CN17.42 ; also sheet 2
DRIVE34+: CN17.16 ; also sheet 2
DRIVE34-: CN17.41 ; also sheet 2
DRIVE35+: CN17.15 ; also sheet 2
DRIVE35-: CN17.40 ; also sheet 2
DRIVE36+: CN17.14 ; also sheet 2
DRIVE36-: CN17.39 ; also sheet 2
DRIVE37+: CN17.13 ; also sheet 2
DRIVE37-: CN17.38 ; also sheet 2
DRIVE38+: CN17.12 ; also sheet 2
DRIVE38-: CN17.37 ; also sheet 2
DRIVE39+: CN17.11 ; also sheet 2
DRIVE39-: CN17.36 ; also sheet 2
DRIVE40+: CN17.10 ; also sheet 2
DRIVE40-: CN17.35 ; also sheet 2
DRIVE41+: CN17.9 ; also sheet 2
DRIVE41-: CN17.34 ; also sheet 2
DRIVE42+: CN17.8 ; also sheet 2
DRIVE42-: CN17.33 ; also sheet 2
DRIVE43+: CN17.7 ; also sheet 2
DRIVE43-: CN17.32 ; also sheet 2
DRIVE44+: CN17.6 ; also sheet 2
DRIVE44-: CN17.31 ; also sheet 2
DRIVE45+: CN17.5 ; also sheet 2
DRIVE45-: CN17.30 ; also sheet 2
DRIVE46+: CN17.4 ; also sheet 2
DRIVE46-: CN17.29 ; also sheet 2
DRIVE47+: CN17.3 ; also sheet 2
DRIVE47-: CN17.28 ; also sheet 2
DRIVE48+: CN17.2 ; also sheet 2
DRIVE48-: CN17.27 ; also sheet 2
DRIVE49+: CN16.1 ; also sheet 2
DRIVE49-: CN16.26 ; also sheet 2
DRIVE50+: CN17.1 ; also sheet 2
DRIVE50-: CN17.26 ; also sheet 2
N$1: CN7.3 D5.C(K1)
N$7: D5.A(A1) R60.1
N$8: D6.A(A1) R61.1
N$78: CN7.4 D6.C(K1)
N$79: CN8.2 CN8.4 CN14.P$1
N$80: CN8.6 CN8.8 CN14.P$2
N$81: CN6.1 CN6.2 CN13.P$1
N$82: CN6.3 CN6.4 CN13.P$2
N$83: CN5.3 CN5.4 CN12.P$2
N$86: CN5.1 CN5.2 CN12.P$1
N$87: CN9.1 CN9.2 F2.1
N$88: F2.2 SW1.3(A:NC)
N$89: CN9.3 CN9.4 CN15.3 CN15.4
N$90: D4.A(A1) R59.1
N$91: CN15.1 CN15.2 SW1.2(A:C)
UI_!TEST!: CN7.9 CN10.2 CN10.3
UI_DDS/!ANALOG!: CN7.13 CN11.2 CN11.3
UI_INT/!EXT!: CN7.12 SW4.2(A:C)
UI_SYNC_C: CN7.5 CN8.1
UI_SYNC_E: CN7.6 CN8.5
UI_SYNC_N: CN7.8 CN8.7
UI_SYNC_P: CN7.7 CN8.3
UI_VD+3V3: CN7.1 R59.2 R60.2 R61.2
UI_X1/!X2!: CN7.11 SW3.2(A:C)
UI_X1/!X10!: CN7.10 SW2.2(A:C)
Unconnected: CN7.14 CN10.1 CN11.1 SW1.1(A:NO) SW2.1(A:NO) SW3.1(A:NO) SW4.1(A:NO)

### Notes on the sheet
- UI Part
- ISOLATED
- SYNC OUT
- DIRECT
- CURRENT MON OUT
- EXT SIG IN
- WARNING IND.: LowBattery
- INFO IND.: External Input
- NORMAL | x10(up)/x1(down)
- TEST
- x2(up)/x1(down)
- DDS
- ANALOG | EXT(up)/INT(down)
- Battery Side | Supply Side
- UI/OUTPUT

## Sheet 4 of 4
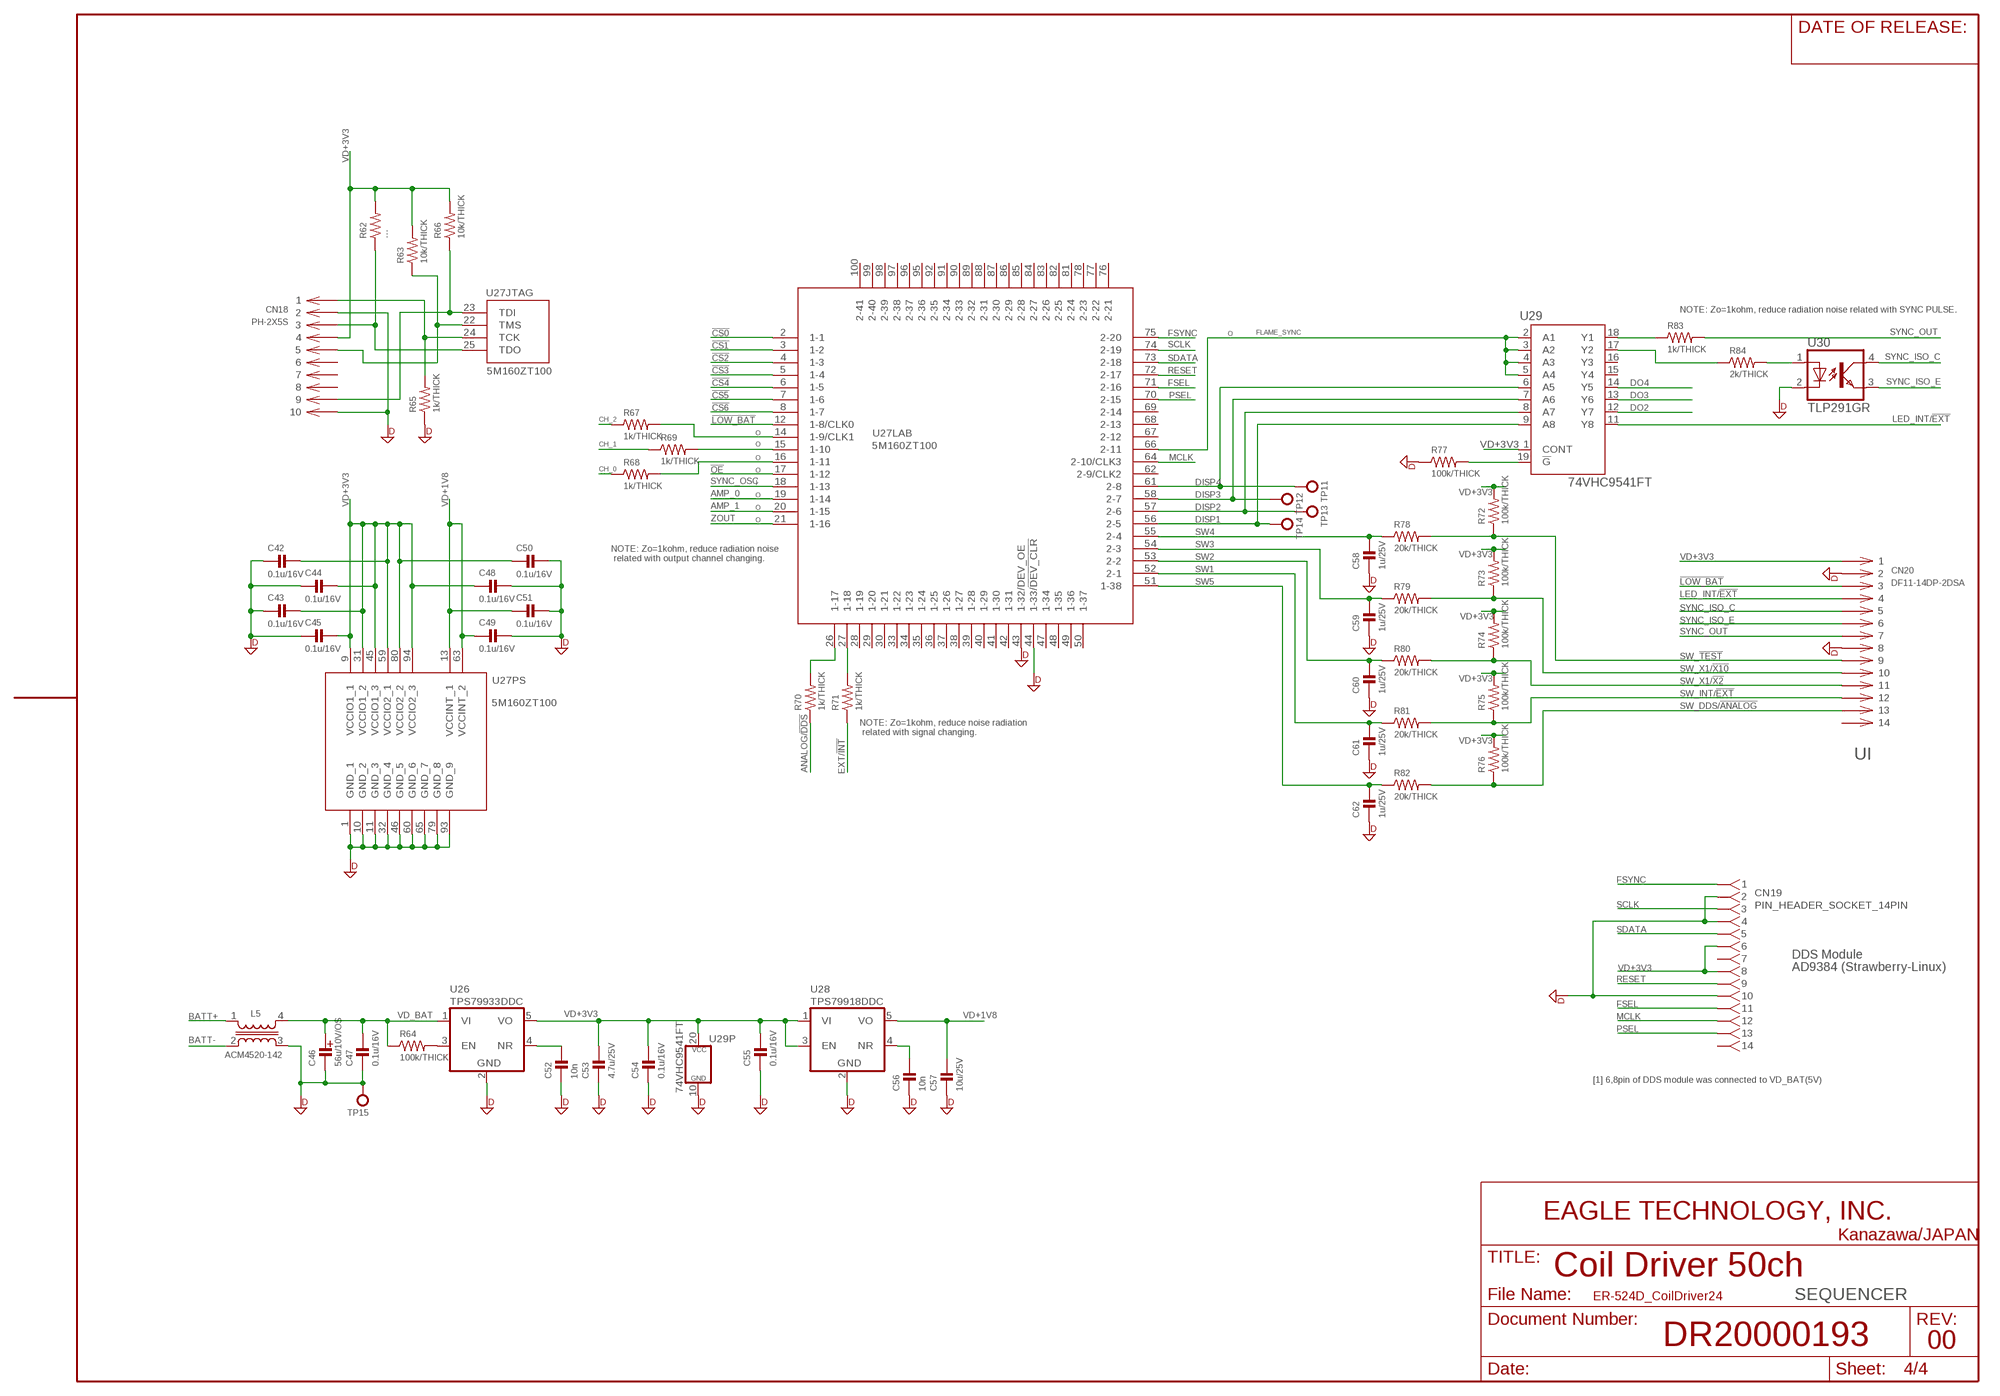
[diagram p4: schematic, sheet 4]

### Parts
C42  0.1u/16V  CSMD1.0X0.5MM  [CM1005]
C43  0.1u/16V  CSMD1.0X0.5MM  [CM1005]
C44  0.1u/16V  CSMD1.0X0.5MM  [CM1005]
C45  0.1u/16V  CSMD1.0X0.5MM  [CM1005]
C46  56u/10V/OS  C_POL6.3-2.5MM  [PHI_6.3]
C47  0.1u/16V  CSMD1.0X0.5MM  [CM1005]
C48  0.1u/16V  CSMD1.0X0.5MM  [CM1005]
C49  0.1u/16V  CSMD1.0X0.5MM  [CM1005]
C50  0.1u/16V  CSMD1.0X0.5MM  [CM1005]
C51  0.1u/16V  CSMD1.0X0.5MM  [CM1005]
C52  10n  CSMD2.0X1.2MM  [CM2012]
C53  4.7u/25V  CSMD2.0X1.2MM  [CM2012]
C54  0.1u/16V  CSMD1.0X0.5MM  [CM1005]
C55  0.1u/16V  CSMD1.0X0.5MM  [CM1005]
C56  10n  CSMD2.0X1.2MM  [CM2012]
C57  10u/25V  CSMD2.0X1.2MM  [CM2012]
C58  1u/25V  CSMD1.6X0.8MM  [CM1608]
C59  1u/25V  CSMD1.6X0.8MM  [CM1608]
C60  1u/25V  CSMD1.6X0.8MM  [CM1608]
C61  1u/25V  CSMD1.6X0.8MM  [CM1608]
C62  1u/25V  CSMD1.6X0.8MM  [CM1608]
CN18  PH-2X5S  PIN_HEADER_10PIN  [PIN_HEADER_10PIN]
CN19  PIN_HEADER_SOCKET_14PIN  [PIN_HEADER_SOCKET_14PIN]
CN20  DF11-14DP-2DSA  [DF11-14DP-2DSA]
L5  ACM4520-142  [ACM4520]
R62  ---  RSMD1.6X0.8MM  [RM1608]
R63  10k/THICK  RSMD1.6X0.8MM  [RM1608]
R64  100k/THICK  RSMD1.6X0.8MM  [RM1608]
R65  1k/THICK  RSMD1.6X0.8MM  [RM1608]
R66  10k/THICK  RSMD1.6X0.8MM  [RM1608]
R67  1k/THICK  RSMD1.6X0.8MM  [RM1608]
R68  1k/THICK  RSMD1.6X0.8MM  [RM1608]
R69  1k/THICK  RSMD1.6X0.8MM  [RM1608]
R70  1k/THICK  RSMD1.6X0.8MM  [RM1608]
R71  1k/THICK  RSMD1.6X0.8MM  [RM1608]
R72  100k/THICK  RSMD1.6X0.8MM  [RM1608]
R73  100k/THICK  RSMD1.6X0.8MM  [RM1608]
R74  100k/THICK  RSMD1.6X0.8MM  [RM1608]
R75  100k/THICK  RSMD1.6X0.8MM  [RM1608]
R76  100k/THICK  RSMD1.6X0.8MM  [RM1608]
R77  100k/THICK  RSMD1.6X0.8MM  [RM1608]
R78  20k/THICK  RSMD1.6X0.8MM  [RM1608]
R79  20k/THICK  RSMD1.6X0.8MM  [RM1608]
R80  20k/THICK  RSMD1.6X0.8MM  [RM1608]
R81  20k/THICK  RSMD1.6X0.8MM  [RM1608]
R82  20k/THICK  RSMD1.6X0.8MM  [RM1608]
R83  1k/THICK  RSMD1.6X0.8MM  [RM1608]
R84  2k/THICK  RSMD1.6X0.8MM  [RM1608]
TP11  TP-1MM_PAD  [TP_PAD_1MM]
TP12  TP-1MM_PAD  [TP_PAD_1MM]
TP13  TP-1MM_PAD  [TP_PAD_1MM]
TP14  TP-1MM_PAD  [TP_PAD_1MM]
TP15  TP-LC3G  [TP_TH_0R9MM]
U26  TPS79933DDC  [SOT-23-5]
U27  5M160ZT100  [QFP100_0.5]
U28  TPS79918DDC  [SOT-23-5]
U29  74VHC9541FT  [TSSOP20-P-0044-065A]
U30  TLP291GR  [SO4(11-3C1)(TOSHIBA)]

### Nets
!CS0: U27.2(LAB:1-1) ; also sheet 2
!CS1: U27.3(LAB:1-2) ; also sheet 2
!CS2: U27.4(LAB:1-3) ; also sheet 2
!CS3: U27.5(LAB:1-4) ; also sheet 2
!CS4: U27.6(LAB:1-5) ; also sheet 2
!CS5: U27.7(LAB:1-6) ; also sheet 2
!CS6: U27.8(LAB:1-7) ; also sheet 2
!LOW_BAT: CN20.3 U27.12(LAB:1-8/CLK0) ; also sheet 1
!OE: U27.17(LAB:1-12)
AMP_0: U27.19(LAB:1-14) ; also sheet 1
AMP_1: U27.20(LAB:1-15) ; also sheet 1
ANALOG/!DDS!: R70.1 ; also sheet 1
BATT+: L5.1 ; also sheet 1
BATT-: L5.2 ; also sheet 1
CH_0: R68.1 ; also sheet 2
CH_1: R69.1 ; also sheet 2
CH_2: R67.1 ; also sheet 2
DGND: C42.2 C43.2 C44.2 C45.2 C46.NEG C47.2 C48.1 C49.1 C50.1 C51.1 C52.2 C53.2 C54.2 C55.2 C56.2 C57.2 C58.2 C59.2 C60.2 C61.2 C62.2 CN18.2 CN18.10 CN19.2 CN19.4 CN19.10 CN20.2 CN20.8 L5.3 R65.1 R77.1 TP15.1(MP) U26.2(GND) U27.1(PS:GND_1) U27.10(PS:GND_2) U27.11(PS:GND_3) U27.32(PS:GND_4) U27.43(LAB:1-32/DEV_OE) U27.44(LAB:1-33/!DEV_CLR) U27.46(PS:GND_5) U27.60(PS:GND_6) U27.65(PS:GND_7) U27.79(PS:GND_8) U27.93(PS:GND_9) U28.2(GND) U29.10(GND) U30.2(C) ; also sheet 1,3
DISP1: TP14.P$1(MP) U27.56(LAB:2-5) U29.9(A8)
DISP2: TP13.P$1(MP) U27.57(LAB:2-6) U29.8(A7)
DISP3: TP12.P$1(MP) U27.58(LAB:2-7) U29.7(A6)
DISP4: TP11.P$1(MP) U27.61(LAB:2-8) U29.6(A5)
DO2: U29.12(Y7)
DO3: U29.13(Y6)
DO4: U29.14(Y5)
EXT/!INT!: R71.1 ; also sheet 1
FLAME_SYNC: U27.66(LAB:2-11) U29.2(A1) U29.3(A2) U29.4(A3) U29.5(A4)
FSEL: CN19.11 U27.71(LAB:2-16)
FSYNC: CN19.1 U27.75(LAB:2-20)
LED_INT/!EXT!: CN20.4 U29.11(Y8)
MCLK: CN19.12 U27.64(LAB:2-10/CLK3)
N$2: R69.2 U27.15(LAB:1-10)
N$3: R68.2 U27.16(LAB:1-11)
N$5: R83.1 U29.18(Y1)
N$6: R77.2 U29.19(!G)
N$10: C52.1 U26.4(NR)
N$15: R64.2 U26.3(EN)
N$44: R70.2 U27.26(LAB:1-17)
N$50: CN18.9 R66.1 U27.23(JTAG:TDI)
N$56: CN18.1 R65.2 U27.24(JTAG:TCK)
N$67: R67.2 U27.14(LAB:1-9/CLK1)
N$70: R71.2 U27.27(LAB:1-18)
N$71: CN18.3 R62.1 U27.25(JTAG:TDO)
N$72: CN18.5 R63.1 U27.22(JTAG:TMS)
N$74: R84.1 U29.17(Y2)
N$75: C56.1 U28.4(NR)
N$77: R84.2 U30.1(A)
PSEL: CN19.13 U27.70(LAB:2-15)
RESET: CN19.9 U27.72(LAB:2-17)
SCLK: CN19.3 U27.74(LAB:2-19)
SDATA: CN19.5 U27.73(LAB:2-18)
SW1: C61.1 R81.1 U27.52(LAB:2-1)
SW2: C60.1 R80.1 U27.53(LAB:2-2)
SW3: C59.1 R79.1 U27.54(LAB:2-3)
SW4: C58.1 R78.1 U27.55(LAB:2-4)
SW5: C62.1 R82.1 U27.51(LAB:1-38)
SW_!TEST!: CN20.9 R72.1 R78.2
SW_DDS/!ANALOG!: CN20.13 R76.1 R82.2
SW_INT/!EXT: CN20.12 R75.1 R81.2
SW_X1/!X2!: CN20.11 R74.1 R80.2
SW_X1/!X10!: CN20.10 R73.1 R79.2
SYNC_ISO_C: CN20.5 U30.4(COL)
SYNC_ISO_E: CN20.6 U30.3(EMI)
SYNC_OSC: U27.18(LAB:1-13) ; also sheet 1
SYNC_OUT: CN20.7 R83.2
VD+1V8: C49.2 C51.2 C57.1 U27.13(PS:VCCINT_1) U27.63(PS:VCCINT_2) U28.5(VO)
VD+3V3: C42.1 C43.1 C44.1 C45.1 C48.2 C50.2 C53.1 C54.1 C55.1 CN18.4 CN19.6 CN19.8 CN20.1 R62.2 R63.2 R66.2 R72.2 R73.2 R74.2 R75.2 R76.2 U26.5(VO) U27.9(PS:VCCIO1_1) U27.31(PS:VCCIO1_2) U27.45(PS:VCCIO1_3) U27.59(PS:VCCIO2_1) U27.80(PS:VCCIO2_2) U27.94(PS:VCCIO2_3) U28.1(VI) U28.3(EN) U29.1(CONT) U29.20(VCC) ; also sheet 1
VD_BAT: C46.POS C47.1 L5.4 R64.1 U26.1(VI) ; also sheet 1
ZOUT: U27.21(LAB:1-16) ; also sheet 1
Unconnected: CN18.6 CN18.7 CN18.8 CN19.7 CN19.14 CN20.14 U27.28(LAB:1-19) U27.29(LAB:1-20) U27.30(LAB:1-21) U27.33(LAB:1-22) U27.34(LAB:1-23) U27.35(LAB:1-24) U27.36(LAB:1-25) U27.37(LAB:1-26) U27.38(LAB:1-27) U27.39(LAB:1-28) U27.40(LAB:1-29) U27.41(LAB:1-30) U27.42(LAB:1-31) U27.47(LAB:1-34) U27.48(LAB:1-35) U27.49(LAB:1-36) U27.50(LAB:1-37) U27.62(LAB:2-9/CLK2) U27.67(LAB:2-12) U27.68(LAB:2-13) U27.69(LAB:2-14) U27.76(LAB:2-21) U27.77(LAB:2-22) U27.78(LAB:2-23) U27.81(LAB:2-24) U27.82(LAB:2-25) U27.83(LAB:2-26) U27.84(LAB:2-27) U27.85(LAB:2-28) U27.86(LAB:2-29) U27.87(LAB:2-30) U27.88(LAB:2-31) U27.89(LAB:2-32) U27.90(LAB:2-33) U27.91(LAB:2-34) U27.92(LAB:2-35) U27.95(LAB:2-36) U27.96(LAB:2-37) U27.97(LAB:2-38) U27.98(LAB:2-39) U27.99(LAB:2-40) U27.100(LAB:2-41) U29.15(Y4) U29.16(Y3)

### Notes on the sheet
- NOTE: Zo=1kohm, reduce radiation noise related with SYNC PULSE.
- O
- O
- O
- O
- O
- I
- O
- O
- O
- NOTE: Zo=1kohm, reduce radiation noise
   related with output channel changing.
- NOTE: Zo=1kohm, reduce noise radiation
   related with signal changing.
- UI
- DDS Module
- AD9384 (Strawberry-Linux)
- [1] 6,8pin of DDS module was connected to VD_BAT(5V)
- SEQUENCER

## Library data of the parts
C1-C7 C9-C22 C24-C45 C47-C62 = AEL_RLC:C: CAPACITOR, European symbol
C8 C23 C46 = AEL_RLC:C_POL: POL Cap Nihon-Chemicon Read components UVR1H100 10uF 5phi, 2.0mm pitch UVR1H470 47uF 6.3phi, 2.5mm pitch UVR1H101 100uF 8phi, 3.5mm pitch Panasonic SO package D: 6.6x6.6 - 5.8mm height J16 : 17x17 - 17mm Height H13: 14x14 - 15mm Height
CN1-CN6 CN9 CN15 = AEL_terminal:DF11-4DP-2DS*
CN7 CN20 = AEL_terminal:DF11-14DP-2DS*
CN8 = AEL_terminal:PH-2X4S: 8 PIN HEADER(2x4), 2.54mm pitch 33mm x 5.3mm Akizuki Part No : C-00080 (40PIN) , @50JPY
CN10 CN11 = AEL_terminal:PH-1X4
CN12-CN14 = AEL_terminal:BNC: The ANGLE type is compatible with - DDK BNC-LNRD - Akituki BNC-J Kiban Torituke-Gata Yokomuki C-00134 - TE 1-1337542 (RS:512-1203) The PANEL type is compatible with any of panel mount BNC connectors.
CN16 CN17 = AEL_terminal:PCS-XE50LFD: SCSI 50PIN Use 2.5mm ISO screw to fix the connector on the board.
CN18 = AEL_terminal:PIN_HEADER_10PIN: 10 PIN HEADER(2x5), 2.54mm pitch 33mm x 5.3mm Akizuki Part No : C-00080 (40PIN) , @50JPY
CN19 = AEL_terminal:PIN_HEADER_SOCKET_14PIN: 2.54mm pitch pin-header scoket
D1 D2 = AEL_diode:1SS372: TOSHIBA SBD High speed switching, Small signal, Low Vf. Vf=0.23V @5mA Ct=20pF(typ)
D3 = AEL_diode:1SS*: Toshiba Diode TO236 Package 1:Anode1, 2:Casode2, 3:Anode2/Casode1; CT: 0.9pF; IR: 0.1uA; VF: 0.9V
D4 D6 = AEL_LED:L-93A8CB: kingBright Angle type Indicator; COLOR: GREEN
D5 = AEL_LED:L-93A8CB: kingBright Angle type Indicator; COLOR: RED
F1 F2 = AEL_FUSE:RXEF*: Poly SW RXEFxxx (72V) Thickness 3mm, Width 8mm, Lead Pitch 5.08(typ) Hight 14mm
L1-L5 = AEL_inductors:ACM4520: TDK Common mode choke coil ACM4520 Series For DC Power line 1.7A - 3.0A / 50V; CURRENT: 1.7A; Z_CM_100M: 1400
M1-M3 = AEL_hole:VAB-3-10
R1 R3-R11 R13-R84 = AEL_RLC:R: RESISTOR, American symbol
R2 R12 = AEL_RLC:R_POT
SW1-SW4 = AEL_SW:A-1*V: NKK PCB mount toggle sw PC-V type/single; FUNCTION: ON-ON; KNOB: normal
TP1-TP9 TP11-TP15 = AEL_terminal:TP-*: Testpoint
U1 U2 U5 U8 = AEL_linear:OPA2344: TI OP AMP OPA2344 Low Vcc RRIO GBW = 1MHz 0.8V/usec Voff = 1mVmax / 3uV/deg Vcc = 2.7 to 5.5 V / Icc0.15mA./amp
U3 U9 = AEL_linear:TS5A23159: TI Analog SW / 2 x SPDT
U4 U26 U28 = AEL_linear:TPS799*: TI LDO TSOT23-5 package Iout = 200mAmax Vdrop = 100mV min Cout >= 2.0uF cer With ENABLE Function
U6 = AEL_linear:TPS3808G: TI Supervisory Circuit TPS3808G01 : programmable voltage; VTH: Programmable
U7 = AEL_linear:NJU7108: COMPARATOR JRC NJU7108 Low Power Voltage 1.0-5.5V/10uA Voff = 4mV Push-Pull output tp = 500ns/190ns
U10 = AEL_CMOS_LOG:74*4052: STD C-MOS Analog MPX 2 x 4 to 1 74**4051 Avairable Technology: HC VHC
U11 = AEL_linear:AD8227: Low Cost INST Amp AD8227 Low noise 0.9uVp-p RTI Vcc 2.2-36V / RR output at low VCC Gain 5-1000 stable / 2MHzBW; LF-CMRR: 90
U12-U25 = AEL_linear:MAX4617C: MAXIM Analog MPX 8 to 1 MAX4617C TSSOP16 0.65mm pitch
U27 = AEL_CMOS_LOG:5M160Z: ALTERA CPLD MAX V series 160LE
U29 = AEL_CMOS_LOG:74*9541: Octal Universal Schmitt Buffer With 3-State Output TOSHIBA TSSOP Package
U30 = AEL_photocoupler:TLP291: Photo Coupler TLP291 TOSHIBA IC/IF = 50 to 400 Ioff=0.01mA ton, toff = 7us @ if=2mA Vdd max = 80V BVs=3750Vrms; IC-IF: 100-400